# Altium schematic sheet Ethernet.SchDoc
size 420 x 297 mm; Address1: Address1; Address2: Address2; Address3: Address3; Address4: Address4; DocumentNumber: *Э3; SheetNumber: 9; SheetTotal: 12; DocumentType: Схема электрическая *
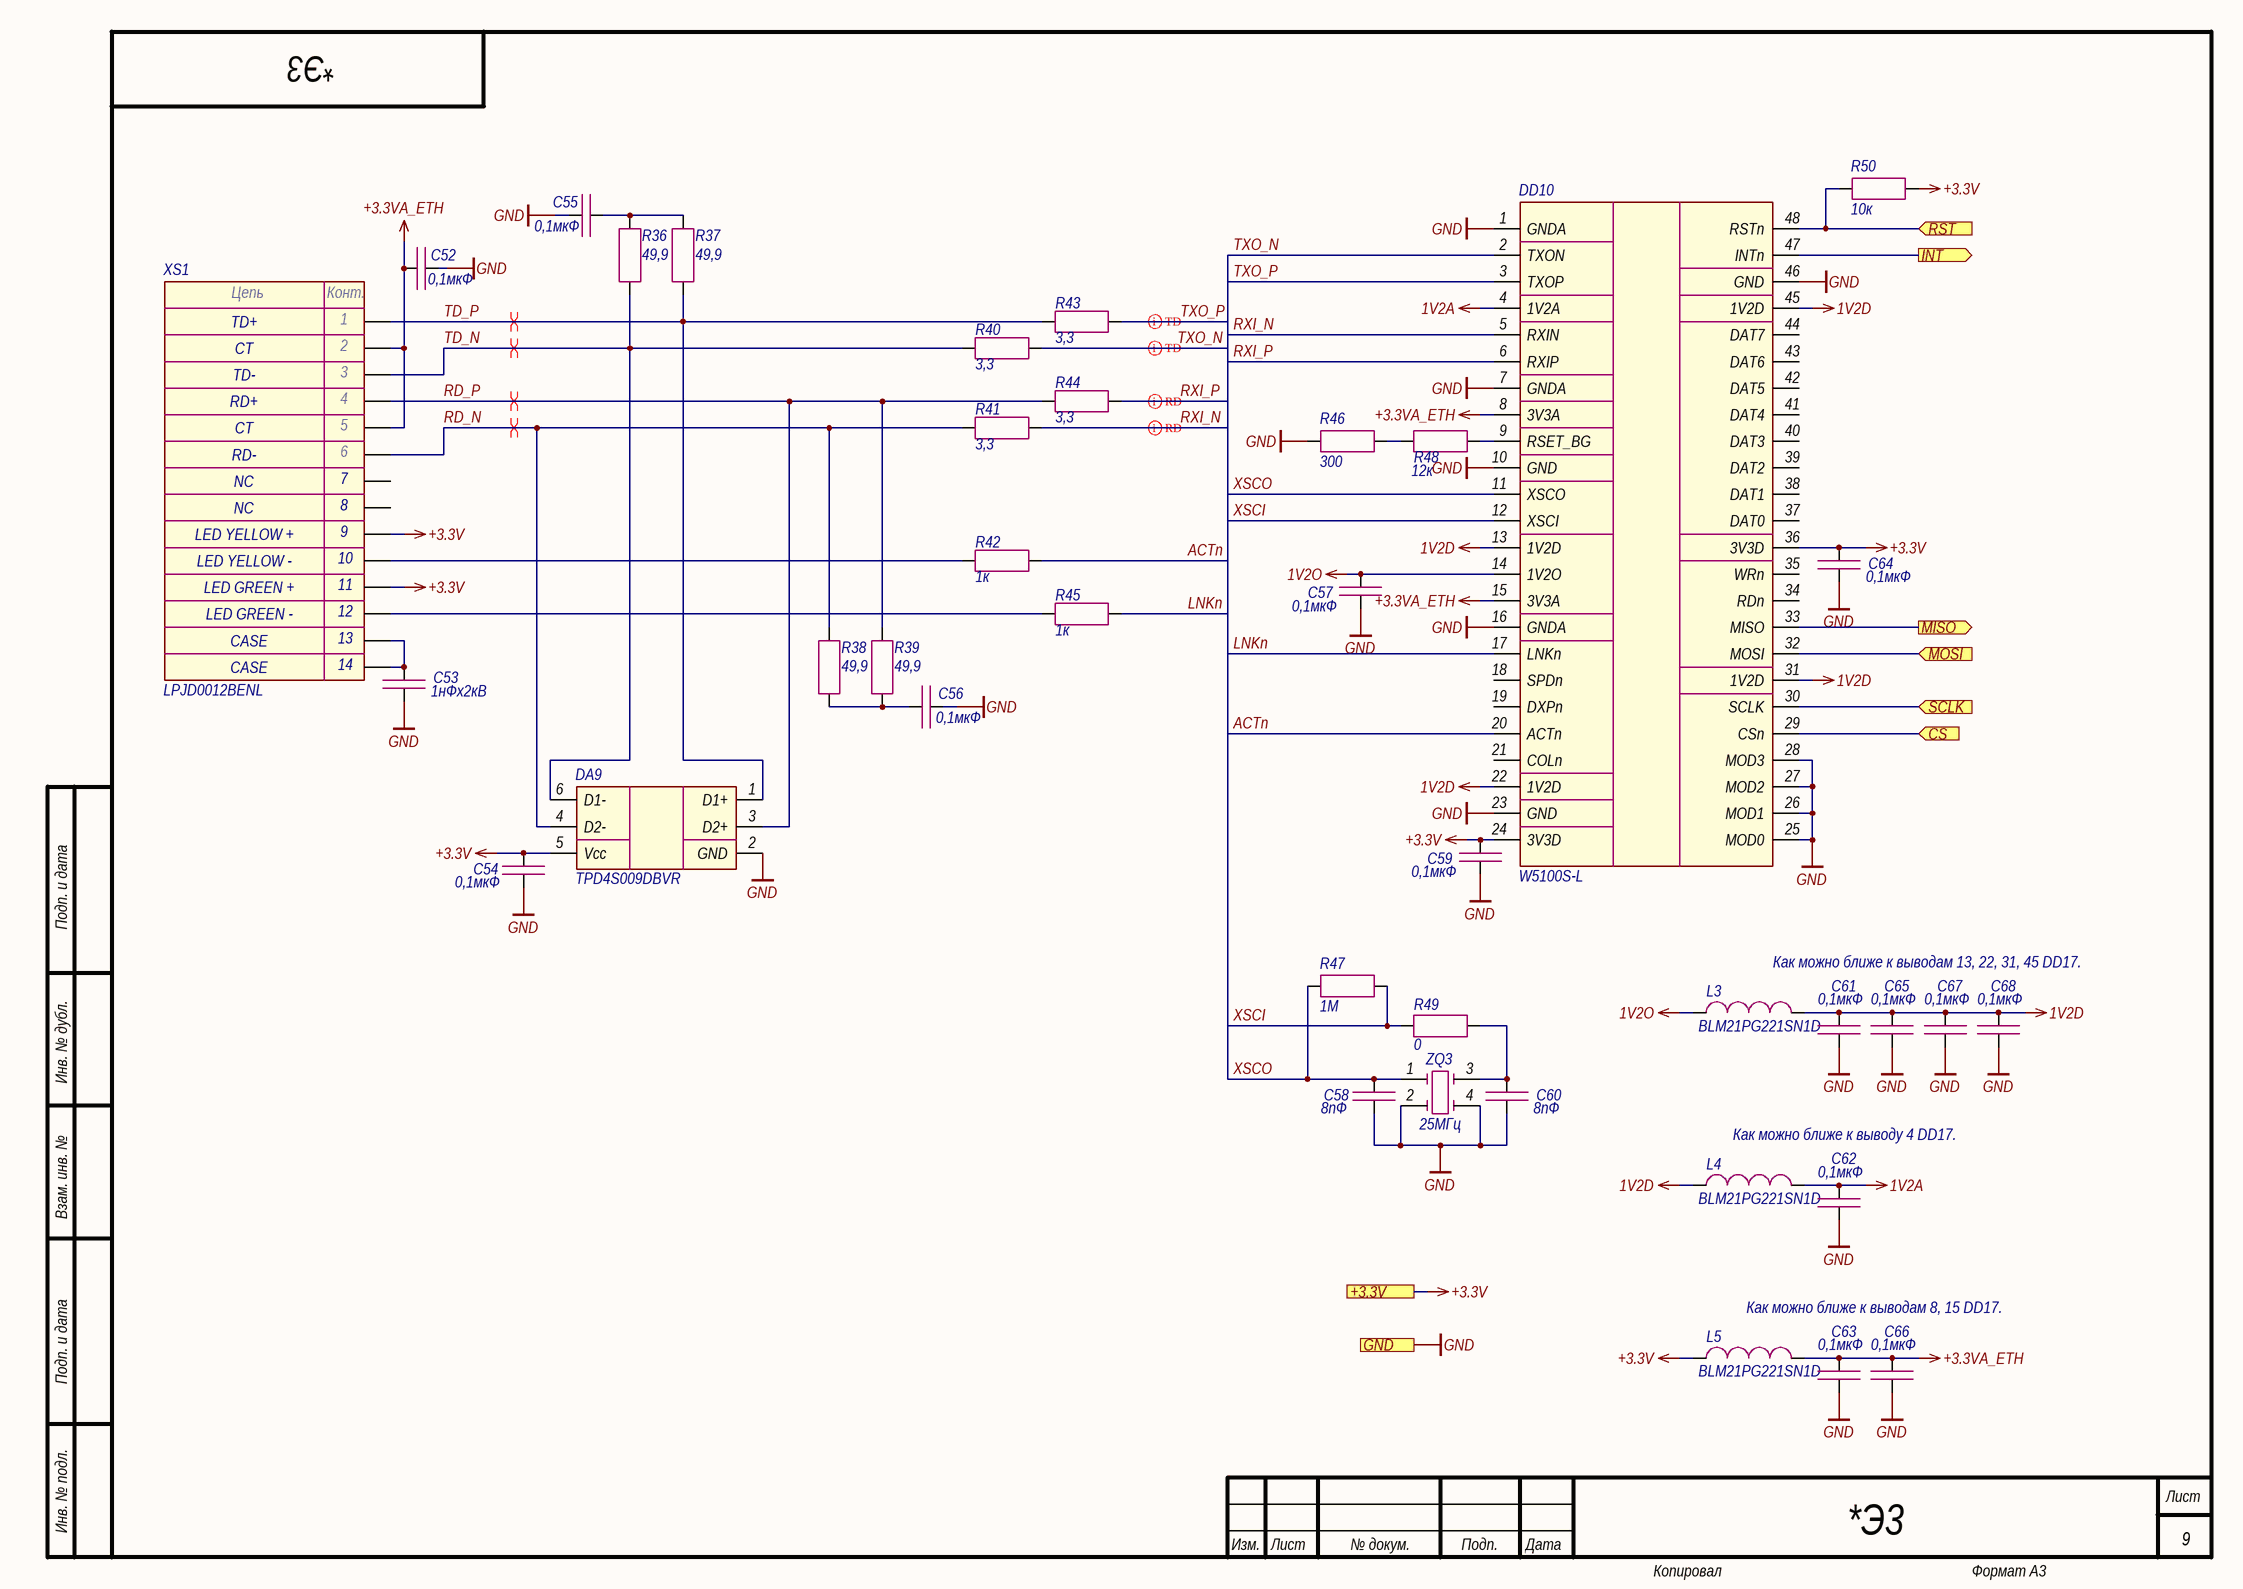
[diagram p0: Ethernet.SchDoc]

## Parts
C52  0,1мкФ  [CAP_0603]
C53  1нФх2кВ  [CAP_1206]
C54  0,1мкФ  [CAP_0603]
C55  0,1мкФ  [CAP_0603]
C56  0,1мкФ  [CAP_0603]
C57  0,1мкФ  [CAP_0603]
C58  8пФ  [CAP_0603]
C59  0,1мкФ  [CAP_0603]
C60  8пФ  [CAP_0603]
C61  0,1мкФ  [CAP_0603]
C62  0,1мкФ  [CAP_0603]
C63  0,1мкФ  [CAP_0603]
C64  0,1мкФ  [CAP_0603]
C65  0,1мкФ  [CAP_0603]
C66  0,1мкФ  [CAP_0603]
C67  0,1мкФ  [CAP_0603]
C68  0,1мкФ  [CAP_0603]
DA9  TPD4S009DBVR  [SOT-23-6]
DD10  W5100S-L  [LQFP-48]
L3  BLM21PG221SN1D  [IND_0805]
L4  BLM21PG221SN1D  [IND_0805]
L5  BLM21PG221SN1D  [IND_0805]
R36  49,9  [RES_0603]
R37  49,9  [RES_0603]
R38  49,9  [RES_0603]
R39  49,9  [RES_0603]
R40  3,3  [RES_0603]
R41  3,3  [RES_0603]
R42  1к  [RES_0603]
R43  3,3  [RES_0603]
R44  3,3  [RES_0603]
R45  1к  [RES_0603]
R46  300  [RES_0603]
R47  1М  [RES_0603]
R48  12к  [RES_0603]
R49  0  [RES_0603]
R50  10к  [RES_0603]
XS1  LPJD0012BENL  [LPJD0012BENL]
ZQ3  25МГц  [7M]

## Ports
+3.3V (see Main[3B], Bus[1D], Button[1D], Fiber_interlock[2C], Flow_sensor[2C], Hardwiring[3D]), CS (in, see Main[2B]), GND (see Main[3B], Bus[1D], Button[1D], Column[1C], Fiber_interlock[2C], Flow_sensor[2C], Guide_laser[1C], Hardwiring[3D], Indication[1C]), INT (out, see Main[3B]), MISO (out, see Main[2B]), MOSI (in, see Main[2B]), RST (in, see Main[3B]), SCLK (in, see Main[2B])

## Nets
1V2A: C62.1 DD10.4(1V2A) L4.2
1V2D: C61.1 C65.1 C67.1 C68.1 DD10.13(1V2D) DD10.22(1V2D) DD10.31(1V2D) DD10.45(1V2D) L3.2 L4.1
1V2O: C57.1 DD10.14(1V2O) L3.1
+3.3V: C54.1 C59.1 C64.1 DA9.5(Vcc) DD10.24(3V3D) DD10.36(3V3D) L5.1 R50.2 XS1.9 XS1.11 ; port +3.3V
+3.3VA_ETH: C52.1 C63.1 C66.1 DD10.8(3V3A) DD10.15(3V3A) L5.2 XS1.2 XS1.5
GND: C52.2 C53.2 C54.2 C55.2 C56.2 C57.2 C58.2 C59.2 C60.2 C61.2 C62.2 C63.2 C64.2 C65.2 C66.2 C67.2 C68.2 DA9.2(GND) DD10.1(GNDA) DD10.7(GNDA) DD10.10(GND) DD10.16(GNDA) DD10.23(GND) DD10.25(MOD0) DD10.26(MOD1) DD10.27(MOD2) DD10.28(MOD3) DD10.46(GND) R46.1 ZQ3.2 ZQ3.4 ; port GND
ACTn: DD10.20(ACTn) R42.2
CS: DD10.29(CSn) ; port CS
INT: DD10.47(INTn) ; port INT
LNKn: DD10.17(LNKn) R45.2
MISO: DD10.33(MISO) ; port MISO
MOSI: DD10.32(MOSI) ; port MOSI
RD_N: DA9.4(D2-) R38.1 R41.2 XS1.6
RD_P: DA9.3(D2+) R39.1 R44.2 XS1.4
RST: DD10.48(RSTn) R50.1 ; port RST
RXI_N: DD10.5(RXIN) R41.1
RXI_P: DD10.6(RXIP) R44.1
SCLK: DD10.30(SCLK) ; port SCLK
TD_N: DA9.6(D1-) R36.1 R40.2 XS1.3
TD_P: DA9.1(D1+) R37.1 R43.2 XS1.1
TXO_N: DD10.2(TXON) R40.1
TXO_P: DD10.3(TXOP) R43.1
XSCI: DD10.12(XSCI) R47.2 R49.1
XSCO: C58.1 DD10.11(XSCO) R47.1 ZQ3.1
NetC53_1: C53.1 XS1.13 XS1.14
NetC55_1: C55.1 R36.2 R37.2
NetC56_1: C56.1 R38.2 R39.2
NetC60_1: C60.1 R49.2 ZQ3.3
NetDD10_9: DD10.9(RSET_BG) R48.2
NetR42_1: R42.1 XS1.10
NetR45_1: R45.1 XS1.12
NetR46_2: R46.2 R48.1

Not connected (* = marked no-connect by the designer): DD10 18(SPDn) 19(DXPn) 21(COLn) 34(RDn) 35(WRn) 37(DAT0) 38(DAT1) 39(DAT2) 40(DAT3) 41(DAT4) 42(DAT5) 43(DAT6) 44(DAT7); XS1 7 8

## Layout directives
differential pair; differential pair class TD: TXO_N, TXO_P
differential pair; differential pair class RD: RXI_N, RXI_P
differential pair: RD_N, RD_P, TD_N, TD_P

## Notes on the sheet
- Как можно ближе к выводам 13, 22, 31, 45 DD17.
- Как можно ближе к выводу 4 DD17.
- Как можно ближе к выводам 8, 15 DD17.
- Подп. и дата
- Инв. № дубл.
- Взам. инв. №
- Инв. № подл.
- Изм.
- Лист
- № докум.
- Подп.
- Дата
- Копировал
- Формат А3
- (in symbol LPJD0012BENL) Цепь; Конт.; TD+; CT; TD-; RD+; RD-; NC; LED YELLOW +; LED YELLOW -; LED GREEN +; LED GREEN -; CASE

## Library data of the parts
C52 C54-C57 C59 C61-C68 = Capacitor: Manufacturer: Murata; Model: GRM188R71H104KA93D; Value: 0,1мкФ; Document: *
C53 = Capacitor: Manufacturer: Yageo; Model: CC1206KKX7RDBB102; Value: 1нФх2кВ; Document: *
C58 C60 = Capacitor: Manufacturer: Yageo; Model: CC0603CRNPO9BN8R0; Value: 8пФ; Document: *
DA9 = TPD4S009: Manufacturer: Texas Instruments; Model: TPD4S009DBVR; Document: *
DD10 = W5100S: Manufacturer: Wiznet; Model: W5100S-L; Document: *
L3-L5 = Inductor: Manufacturer: Murata; Value: *; Model: BLM21PG221SN1D; Document: *
R36-R39 = Resistor: Manufacturer: Yageo; Model: RC0603FR-0749R9L; Value: 49,9; Document: *
R40 R41 R43 R44 = Resistor: Manufacturer: Yageo; Model: RC0603FR-073R3L; Value: 3,3; Document: *
R42 R45 = Resistor: Manufacturer: Yageo; Model: RC0603FR-071KL; Value: 1к; Document: *
R46 = Resistor: Manufacturer: Yageo; Model: RC0603FR-07300RL; Value: 300; Document: *
R47 = Resistor: Manufacturer: Yageo; Model: RC0603FR-071ML; Value: 1М; Document: *
R48 = Resistor: Manufacturer: Yageo; Model: RC0603FR-0712KL; Value: 12к; Document: *
R49 = Resistor: Manufacturer: Yageo; Model: RC0603JR-070RL; Value: 0; Document: *
R50 = Resistor: Manufacturer: Yageo; Model: RC0603FR-0710KL; Value: 10к; Document: *
XS1 = LPJD0012BENL: Manufacturer: LINK-PP; Model: LPJD0012BENL; Document: *
ZQ3 = Quartz_Resonator_4-pin: Manufacturer: TXC; Model: 7M-25.000MAAJ-T; Value: 25МГц; Document: *